# Altium schematic sheet BUZT13-01CN-E-201-20140930.SchDoc
size B; SheetNumber: 0; SheetTotal: 0
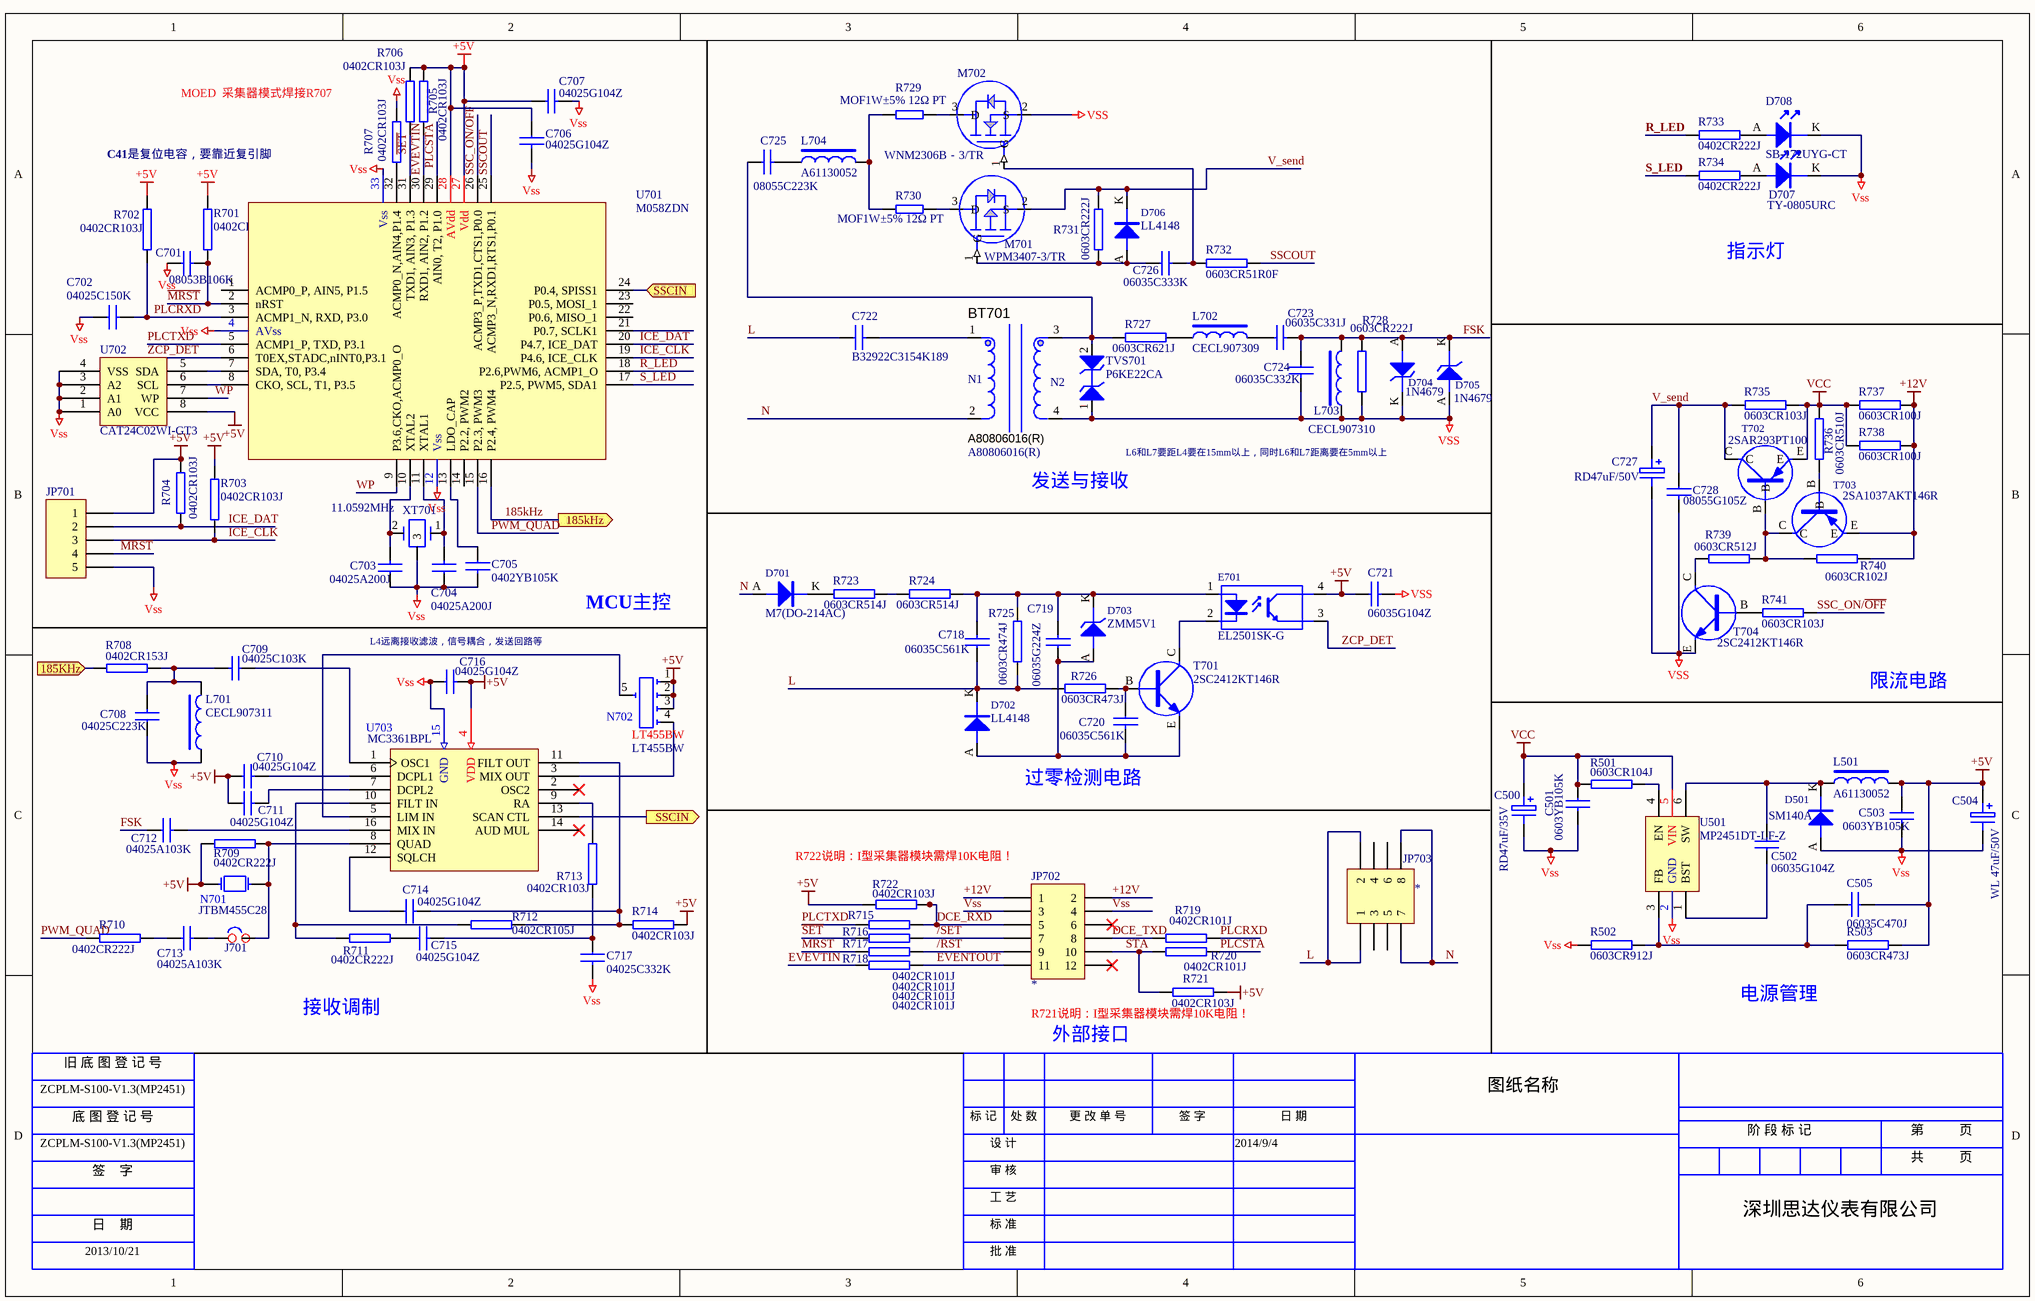
[diagram p0: BUZT13-01CN-E-201-20140930.SchDoc]

## Parts
BT701  A80806016(R)  [OHXQ_1]
C500  RD47uF/35V  [CAP_ELE_5.0_2.0]
C501  0603YB105K  [CAP_SMD_0603]
C502  06035G104Z  [CAP_SMD_0603]
C503  0603YB105K  [CAP_SMD_0603]
C504  WL 47uF/50V  [CAP_ELE_6.3_2.5]
C505  06035C470J  [CAP_SMD_0603]
C701  08053B106K  [CAP_SMD_0805]
C702  04025C150K  [CAP_SMD_0402]
C703  04025A200J  [CAP_SMD_0402]
C704  04025A200J  [CAP_SMD_0402]
C705  0402YB105K  [CAP_SMD_0402]
C706  04025G104Z  [CAP_SMD_0402]
C707  04025G104Z  [CAP_SMD_0402]
C708  04025C223K  [CAP_SMD_0402]
C709  04025C103K  [CAP_SMD_0402]
C710  04025G104Z  [CAP_SMD_0402]
C711  04025G104Z  [CAP_SMD_0402]
C712  04025A103K  [CAP_SMD_0402]
C713  04025A103K  [CAP_SMD_0402]
C714  04025G104Z  [CAP_SMD_0402]
C715  04025G104Z  [CAP_SMD_0402]
C716  04025G104Z  [CAP_SMD_0402]
C717  04025C332K  [CAP_SMD_0402]
C718  06035C561K  [CAP_SMD_0603]
C719  06035G224Z  [CAP_SMD_0603]
C720  06035C561K  [CAP_SMD_0603]
C721  06035G104Z  [CAP_SMD_0603]
C722  B32922C3154K189  [CAP_PFC_15_18_8.5]
C723  06035C331J  [CAP_SMD_0603]
C724  06035C332K  [CAP_SMD_0603]
C725  08055C223K  [CAP_SMD_0805]
C726  06035C333K  [CAP_SMD_0603]
C727  RD47uF/50V  [CAP_ELE_6.3_2.5]
C728  08055G105Z  [CAP_SMD_0805]
D501  SM140A  [DO-214AC]
D701  M7(DO-214AC)  [DO-214AC]
D702  LL4148  [LL-34]
D703  ZMM5V1  [LL-34]
D704  1N4679  [DIODE-I]
D705  1N4679  [DIODE-I]
D706  LL4148  [LL-34]
D707  TY-0805URC  [LED_0805]
D708  SB-172UYG-CT  [LED_0805]
E701  EL2501SK-G  [OPT_SOP]
J701  CA_PAD  [CA_PAD]  (value not drawn)
JP701  (no value)  [CON_S_5]
JP702  *  [CON_D_12]
JP703  *  [CON_D_8]
L501  A61130052  [IND_PLU_2_5]
L701  CECL907311  [L4.0-4.5]
L702  CECL907309  [L4.0-4.5]
L703  CECL907310  [L4.0-4.5]
L704  A61130052  [IND_PLU_2_5]
M701  WPM3407-3/TR  [SOT-23-3]
M702  WNM2306B－3/TR  [SOT-23-3]
N701  JTBM455C28  [JTBM455C28]
N702  LT455BW  [LT4551]
R501  0603CR104J  [RES_SMD_0603]
R502  0603CR912J  [RES_SMD_0603]
R503  0603CR473J  [RES_SMD_0603]
R701  0402CR103J  [RES_SMD_0402]
R702  0402CR103J  [RES_SMD_0402]
R703  0402CR103J  [RES_SMD_0402]
R704  0402CR103J  [RES_SMD_0402]
R705  0402CR103J  [RES_SMD_0402]
R706  0402CR103J  [RES_SMD_0402]
R707  0402CR103J  [RES_SMD_0402]
R708  0402CR153J  [RES_SMD_0402]
R709  0402CR222J  [RES_SMD_0402]
R710  0402CR222J  [RES_SMD_0402]
R711  0402CR222J  [RES_SMD_0402]
R712  0402CR105J  [RES_SMD_0402]
R713  0402CR103J  [RES_SMD_0402]
R714  0402CR103J  [RES_SMD_0402]
R715  0402CR101J  [RES_SMD_0402]
R716  0402CR101J  [RES_SMD_0402]
R717  0402CR101J  [RES_SMD_0402]
R718  0402CR101J  [RES_SMD_0402]
R719  0402CR101J  [RES_SMD_0402]
R720  0402CR101J  [RES_SMD_0402]
R721  0402CR103J  [RES_SMD_0402]
R722  0402CR103J  [RES_SMD_0402]
R723  0603CR514J  [RES_SMD_0603]
R724  0603CR514J  [RES_SMD_0603]
R725  0603CR474J  [RES_SMD_0603]
R726  0603CR473J  [RES_SMD_0603]
R727  0603CR621J  [RES_SMD_0603]
R728  0603CR222J  [RES_SMD_0603]
R729  MOF1W±5% 12Ω PT  [LCEC-101L]
R730  MOF1W±5% 12Ω PT  [LCEC-101L]
R731  0603CR222J  [RES_SMD_0603]
R732  0603CR51R0F  [RES_SMD_0603]
R733  0402CR222J  [RES_SMD_0402]
R734  0402CR222J  [RES_SMD_0402]
R735  0603CR103J  [RES_SMD_0603]
R736  0603CR510J  [RES_SMD_0603]
R737  0603CR100J  [RES_SMD_0603]
R738  0603CR100J  [RES_SMD_0603]
R739  0603CR512J  [RES_SMD_0603]
R740  0603CR102J  [RES_SMD_0603]
R741  0603CR103J  [RES_SMD_0603]
T701  2SC2412KT146R  [SOT-23_BCE]
T702  2SAR293PT100  [SOT-428]
T703  2SA1037AKT146R  [SOT-23_BCE]
T704  2SC2412KT146R  [SOT-23_BCE]
TVS701  P6KE22CA  [TVS0.14L]
U501  MP2451DT-LF-Z  [SOT-23 - 6L]
U701  M058ZDN  [QFN-33]
U702  CAT24C02WI-GT3  [SO-8]
U703  MC3361BPL  [SOP-16]
XT701  11.0592MHz  [XTAL_PLU_HC-49US]

## Ports
185KHz (in), 185kHz (out), SSCIN (in), SSCIN (out)

## Nets
+5V: C503.1 C504.1 C505.1 C706.1 C707.1 C710.1 C711.1 C716.2 C721.1 E701.4(C) JP701.1 L501.2 N701.1 N702.1 N702.2 N702.3 R503.2 R701.1 R702.1 R703.2 R704.2 R705.1 R706.1 R709.1 R714.2 R721.2 R722.1 U701.27(Vdd) U701.28(AVdd) U702.8(VCC) U703.4(VDD)
+12V: JP702.1 JP702.2 R737.2 R738.2 R740.2 T703.E
VCC: C500.1 C501.1 R501.1 R735.2 R736.2 R737.1 R738.1 T702.E U501.5(VIN)
Vss: BT701.4(B2) C500.2 C501.2 C503.2 C504.2 C701.1 C702.1 C703.1 C704.1 C705.2 C706.2 C707.2 C708.1 C716.1 C717.2 C721.2 C724.2 C727.2 C728.2 D501.A D704.K D705.A D707.K D708.K JP701.5 JP702.3 JP702.4 L701.1 L703.1 M702.2(S) R502.1 R707.1 R728.1 T704.E TVS701.1 U501.2(GND) U701.4(AVss) U701.12(Vss) U701.33(Vss) U702.1(A0) U702.2(A1) U702.3(A2) U702.4(VSS) U703.15(GND) XT701.3
185kHz: R708.1 U701.16(P2.4,_PWM4) ; port 185KHz, port 185kHz
/RST: JP702.9 R717.2
/SET: JP702.7 R716.2
DCE_RXD: JP702.5 R715.2 R722.2
DCE_TXD: JP702.8 R719.1
EVENTOUT: JP702.11 R718.2
EVEVTIN: R705.2 R718.1 U701.30(RXD1,_AIN2,_P1.2)
FSK: C712.1 C723.2 C724.1 D704.A D705.K L703.2 R728.2
ICE_CLK: JP701.3 R703.1 U701.19(P4.6,_ICE_CLK)
ICE_DAT: JP701.2 R704.1 U701.20(P4.7,_ICE_DAT)
L: C718.1 C722.1 D702.K JP703.1 JP703.2 R725.1 R726.1
~{MRST}: C701.2 JP701.4 R701.2 R717.1 U701.2(nRST)
N: BT701.2(A2) D701.A JP703.7 JP703.8
PLCRXD: C702.2 R702.2 R719.2 U701.3(ACMP1_N,_RXD,_P3.0)
PLCSTA: R720.2 U701.29(AIN0,_T2,_P1.0)
PLCTXD: R715.1 U701.5(ACMP1_P,_TXD,_P3.1)
PWM_QUAD: R710.1 U701.15(P2.3,_PWM3)
R_LED: R733.1 U701.18(P2.6,PWM6,_ACMP1_O)
~{SET}: R706.2 R716.1 U701.31(TXD1,_AIN3,_P1.3)
S_LED: R734.1 U701.17(P2.5,_PWM5,_SDA1)
SSC_ON/~{OFF}: R741.2 U701.26(ACMP3_P,TXD1,CTS1,P0.0)
SSCIN: U701.24(P0.4,_SPISS1) U703.13(SCAN_CTL) ; port SSCIN
SSCOUT: R732.2 U701.25(ACMP3_N,RXD1,RTS1,P0.1)
STA: JP702.10 R720.1 R721.1
V_send: C727.1 C728.1 D706.K M701.2(S) R731.2 R735.1 T702.C
WP: U701.9(P3.6,CKO,ACMP0_O) U702.7(WP)
ZCP_DET: E701.3(E) U701.6(T0EX,STADC,nINT0,P3.1)
NetBT701_1: BT701.1(A1) C722.2
NetBT701_3: BT701.3(B1) C725.1 R727.1 TVS701.2(K)
NetC502_1: C502.1 U501.1(BST)
NetC502_2: C502.2 D501.K L501.1 U501.6(SW)
NetC505_2: C505.2 R502.2 R503.1 U501.3(FB)
NetC703_2: C703.2 U701.10(XTAL2) XT701.2(S4)
NetC704_2: C704.2 U701.11(XTAL1) XT701.1(S1)
NetC705_1: C705.1 U701.13(LDO_CAP)
NetC708_2: C708.2 C709.2 L701.2 R708.2
NetC709_1: C709.1 U703.1(OSC1)
NetC710_2: C710.2 U703.6(DCPL1)
NetC711_2: C711.2 U703.7(DCPL2)
NetC712_2: C712.2 U703.16(MIX_IN)
NetC713_1: C713.1 R710.2
NetC713_2: C713.2 J701.1
NetC714_1: C714.1 U703.12(SQLCH)
NetC714_2: C714.2 R712.2 R714.1 U703.11(FILT_OUT)
NetC715_1: C715.1 R711.2
NetC715_2: C715.2 C717.1 R713.1
NetC718_2: C718.2 C719.2 D703.K E701.1(A) R724.2 R725.2
NetC719_1: C719.1 C720.2 D702.A D703.A T701.E
NetC720_1: C720.1 R726.2 T701.B
NetC723_1: C723.1 L702.2
NetC725_2: C725.2 L704.1
NetC726_1: C726.1 D706.A M701.1(G) R731.1
NetC726_2: C726.2 M702.1(G) R732.1
NetD701_K: D701.K R723.1
NetD707_A: D707.A R734.2
NetD708_A: D708.A R733.2
NetE701_2: E701.2(K) T701.C
NetJ701_2: J701.2 N701.2 R709.2 U703.8(QUAD)
NetL702_1: L702.1 R727.2
NetL704_2: L704.2 R729.1 R730.1
NetM701_3: M701.3(D) R730.2
NetM702_3: M702.3(D) R729.2
NetN702_4: N702.4 U703.3(MIX_OUT)
NetN702_5: N702.5 U703.5(LIM_IN)
NetR501_2: R501.2 U501.4(EN)
NetR707_2: R707.2 U701.32(ACMP0_N,AIN4,P1.4)
NetR711_1: R711.1 R712.1 U703.10(FILT_IN)
NetR713_2: R713.2 U703.9(RA)
NetR723_2: R723.2 R724.1
NetR736_1: R736.1 T703.B
NetR739_1: R739.1 T704.C
NetR739_2: R739.2 R740.1 T702.B T703.C
NetR741_1: R741.1 T704.B
NetU701_7: U701.7(SDA,_T0,_P3.4) U702.5(SDA)
NetU701_8: U701.8(CKO,_SCL,_T1,_P3.5) U702.6(SCL)

Not connected (* = marked no-connect by the designer): JP702 6* 12*; JP703 3 4 5 6; U701 1(ACMP0_P,_AIN5,_P1.5) 14(P2.2,_PWM2) 21(P0.7,_SCLK1) 22(P0.6,_MISO_1) 23(P0.5,_MOSI_1); U703 2(OSC2)* 14(AUD_MUL)*

## Notes on the sheet
- MOED  采集器模式焊接R707
- C41是复位电容，要靠近复引脚
- 指示灯
- 发送与接收
- L6和L7要距L4要在15mm以上，同时L6和L7距离要在5mm以上
- (near C716) L4远离接收滤波，信号耦合，发送回路等
- MCU主控
- 限流电路
- 过零检测电路
- R722说明：I型采集器模块需焊10K电阻！
- 接收调制
- (near R721) R721说明：I型采集器模块需焊10K电阻！
- 外部接口
- 电源管理
- 旧 底 图 登 记 号
- ZCPLM-S100-V1.3(MP2451)
- 底 图 登 记 号
- 签    字
- 标 记
- 设 计
- 审 核
- 处 数
- 更 改 单 号
- 签 字
- 日 期
- 2014/9/4
- 图纸名称
- 阶 段 标 记
- 第          页
- 共          页
- 日    期
- 工 艺
- 标 准
- DDSI780单相电子式
- V5.0
- 1
- 2013/10/21
- 批 准
- 深圳思达仪表有限公司
- (in symbol 2115BU01CN01) N1; N2

## Library data of the parts
BT701 = 2115BU01CN01: Name: 耦合线圈（预研项目物料）; Spec: 插件,原边1000uH,副边1000uH; Value: A80806016(R); Part Number: 2115BU01CN01; Part Type: 2115-耦合线圈
C500 = 203204705102: Name: 电解电容; Spec: 47uF,插件,Ф5×11,脚距:2.0mm,±20%,35V,2000h,-55～＋105℃,三和; Value: RD47uF/35V; Part Number: 203204705102; Part Type: 电解电容脚距2.0
C501 C503 C705 = 203031052501: Name: 贴片电容; Spec: 1μF,0603,±10%,X5R,16V; Part Number: 203031052501; Part Type: 贴片电容封装0603
  C501 C503: Value: 0603YB105K
  C705: Value: 0402YB105K
C502 C706 C707 C710 C711 C714-C716 C721 = 203031044302: Name: 贴片电容; Spec: 100nF,0603,Z=+80 -20%,Y5V,50V; Part Number: 203031044302; Part Type: 贴片电容封装0603
  C502 C721: Value: 06035G104Z
  C706 C707 C710 C711 C714-C716: Value: 04025G104Z
C504 = YZ0100000213: Name: 电解电容; Spec: 47uF,插件,Ф6.3×11, 50V,5000h,脚距:2.5mm, -55～＋105℃; Value: WL 47uF/50V; Part Number: YZ0100000213; Part Type: YZ01-郑州产品电子物料
C505 = 203034704201: Name: 贴片电容; Spec: 47pF,0603,±5%,X7R,50V; Value: 06035C470J; Part Number: 203034704201; Part Type: 贴片电容封装0603
C701 = 203021063501: Name: 贴片电容; Spec: 10uF,0805,±10%,X5R,25V; Value: 08053B106K; Part Number: 203021063501; Part Type: 贴片电容封装0805
C702 = 203031504201: Name: 贴片电容; Spec: 15pF,0603,±10%,X7R,50V; Value: 04025C150K; Part Number: 203031504201; Part Type: 贴片电容封装0603
C703 C704 = 203032004101: Name: 贴片电容; Spec: 20pF,0603,±5%,NPO,50V; Value: 04025A200J; Part Number: 203032004101; Part Type: 贴片电容封装0603
C708 = 203032234201: Name: 贴片电容; Spec: 22nF,0603,±10%,X7R,50V; Value: 04025C223K; Part Number: 203032234201; Part Type: 贴片电容封装0603
C709 = 203031034201: Name: 贴片电容; Spec: 10nF,0603,±10%,X7R,50V; Value: 04025C103K; Part Number: 203031034201; Part Type: 贴片电容封装0603
C712 C713 = 203031034101: Name: 贴片电容; Spec: 10nF,0603,±10%,NPO,50V; Value: 04025A103K; Part Number: 203031034101; Part Type: 贴片电容封装0603
C717 C724 = 203033324201: Name: 贴片电容; Spec: 3.3nF,0603,±10%,X7R,50V; Part Number: 203033324201; Part Type: 贴片电容封装0603
  C717: Value: 04025C332K
  C724: Value: 06035C332K
C718 C720 = 203035614201: Name: 贴片电容; Spec: 560pF,0603,±10%,X7R,50V; Value: 06035C561K; Part Number: 203035614201; Part Type: 贴片电容封装0603
C719 = 203032244302: Name: 贴片电容; Spec: 220nF,0603,Z=+80 -20%,Y5V,50V; Value: 06035G224Z; Part Number: 203032244302; Part Type: 贴片电容封装0603
C722 = 203315430401: Name: 薄膜电容; Spec: 0.15uF,插件,脚距:15mm,±10%,额定电压：305VAC,耐压：2121V，2S ,小于110℃,EPCOS; Value: B32922C3154K189; Part Number: 203315430401; Part Type: 聚脂电容脚距15
C723 = YZ0100000211: Name: 0603贴片电容; Spec: NPO,50V,±5%; Value: 06035C331J; Part Number: YZ0100000211; Part Type: YZ01-郑州产品电子物料
C725 = 203022234202: Name: 贴片电容; Spec: 22nF,0805,±10%,X7R,50V; Value: 08055C223K; Part Number: 203022234202; Part Type: 贴片电容封装0805
C726 = 203033334201: Name: 贴片电容; Spec: 33nF,0603,±10%,X7R,50V; Value: 06035C333K; Part Number: 203033334201; Part Type: 贴片电容封装0603
C727 = 203204706201: Name: 电解电容; Spec: 47uF,插件,Ф6×12,脚距:2.5mm,±20%,50V,1000h,-55～＋105℃,三和; Value: RD47uF/50V; Part Number: 203204706201; Part Type: 电解电容脚距2.5
C728 = 203021054302: Name: 贴片电容; Spec: 1uF,0805,Z=+80 -20%,Y5V,50V; Value: 08055G105Z; Part Number: 203021054302; Part Type: 贴片电容封装0805
D501 = 205105012002: Name: 肖特基二极管（预研项目物料）; Spec: 贴片DO-214AC,肖特基,1.0A,反向耐压：40V,正向压降：0.50V,–40 to +125℃,-; Value: SM140A; Part Number: 205105012002; Part Type: 贴片肖特基二极管
D701 = 205101012001: Name: 整流二极管; Spec: 贴片DO-214AC,硅管,1.0A,反向耐压：1000V,正向压降：1.1V,-55~150℃,标识：M7; Value: M7(DO-214AC); Part Number: 205101012001; Part Type: 贴片硅管
D702 D706 = 205205012002: Name: 开关二极管; Spec: 贴片LL-34,300mA,正向压降：0.8V,反向耐压：75V,开关时间：4ns,150oC,标识：LL4148; Value: LL4148; Part Number: 205205012002; Part Type: 贴片开关二极管
D703 = 205000003201: Name: 稳压二极管; Spec: 贴片LL-34,5.1V,0.5W,±5％,标识：ZMM5V1,ST先科; Value: ZMM5V1; Part Number: 205000003201; Part Type: 贴片稳压二极管
D704 D705 = 205046793101: Name: 稳压二极管（预研项目物料）; Spec: 插件DO-35,2V,0.5W,±5％,-,ST; Value: 1N4679; Part Number: 205046793101; Part Type: 插件稳压二极管
D707 = 210017100203: Name: 发光二极管; Spec: 0805,无色透明,红色,高亮,2.5 V,20 mA,5 V,-40~85℃,130mCD; Value: TY-0805URC; Part Number: 210017100203; Part Type: 贴片发光二极管0805
D708 = 210017G00301: Name: 发光二极管; Spec: 0805,无色透明,发绿色,超高亮,2.1V,30mA,5V,-30~80℃,45mcd; Value: SB-172UYG-CT; Part Number: 210017G00301; Part Type: 贴片发光二极管0805
E701 = 210402012002: Name: 贴片光耦; Spec: 贴片,5.0kV,CTR：300~600%,-55~+110℃,5V,Vceo:80V,Everlight (亿光); Value: EL2501SK-G; Part Number: 210402012002; Part Type: 贴片光耦
J701 = 291000000001: WithOutBom; Name: 虚拟修调焊盘; Part Number: 291000000001; Part Type: 虚拟元器件
JP701 = 230105140001: Name: 插座; Spec: 五芯,单排,脚距:2.54mm,普通; Part Number: 230105140001; Part Type: 2301-插座
JP702 = 230212104005: Name: 排针; Spec: 十二芯,双排,直脚,脚距:2.54mm,-40℃~105℃; Value: *; Part Number: 230212104005; Part Type: 2302-排针
JP703 = 230308104002: Name: 排针插座; Spec: 10.56*5.0*7.1mm,8芯(4*2), 中间四芯为空,双排,直脚,脚距:2.54mm,图号：DDZY23C-Z-01CN-JQ28-03-C  A0; Value: *; Part Number: 230308104002; Part Type: 2303-排针插座
L501 L704 = 211110012002: Name: 插件电感（预研项目物料）; Spec: 插件,10uH,±10%,1.2A,-,-,0.12Ω,-,中山市高雅; Value: A61130052; Part Number: 211110012002; Part Type: 2111-插件电感
L701 = 211133003201: Name: 插件电感（预研项目物料）; Spec: 插件0410,33uH,±5%,320mA,Q值:30(Min),6.0MHz,1.1Ω,-,中山市高雅; Value: CECL907311; Part Number: 211133003201; Part Type: 2111-插件电感
L702 = 211110200601: Name: 插件电感（预研项目物料）; Spec: 插件0410,1.0mH,±5%,60mA,Q值:45(Min),1.0MHz,20Ω,-,中山市高雅; Value: CECL907309; Part Number: 211110200601; Part Type: 2111-插件电感
L703 = 211110101604: Name: 插件电感（预研项目物料）; Spec: 插件0410,100uH,±5%,160mA,Q值:30(Min),3.5MHz,3.5Ω,-,中山市高雅; Value: CECL907310; Part Number: 211110101604; Part Type: 2111-插件电感
M701 = 208105022001: Name: 场效应管; Spec: SOT-23-3,P沟道增强型FET,WP7Z,willsemi; Value: WPM3407-3/TR; Part Number: 208105022001; Part Type: 场效应管(MOS管)P沟道
M702 = 208105012001: Name: 场效应管; Spec: SOT-23-3,N沟道增强型FET,-,willsemi; Value: WNM2306B－3/TR; Part Number: 208105012001; Part Type: 场效应管(MOS管)N沟道
N701 = 207202011001: Name: 陶瓷鉴频器（预研项目物料）; Spec: 插件,-20~+80℃,江佳; Value: JTBM455C28; Part Number: 207202011001; Part Type: 2072-滤波器
N702 = 207202011002: Name: 陶瓷滤波器（预研项目物料）; Spec: 插件,-20~+80℃,江佳; Value: LT455BW; Part Number: 207202011002; Part Type: 2072-滤波器
R501 = 201031003301: Name: 贴片电阻; Spec: 100KΩ,0603,±5%,耐压:>100V,1/10W,±100ppm/℃; Value: 0603CR104J; Part Number: 201031003301; Part Type: 贴片电阻封装0603精度J
R502 = 201039101001: Name: 贴片电阻; Spec: 9.1KΩ,0603,±5%,耐压:>100V,1/10W,±100ppm/℃; Value: 0603CR912J; Part Number: 201039101001; Part Type: 贴片电阻封装0603精度J
R503 R726 = 201034702301: Name: 贴片电阻; Spec: 47KΩ,0603,±5%,耐压:>100V,1/10W,±100ppm/℃; Value: 0603CR473J; Part Number: 201034702301; Part Type: 贴片电阻封装0603精度J
R701-R707 R713 R714 R721 R722 R735 R741 = 201031002301: Name: 贴片电阻; Spec: 10KΩ,0603,±5%,耐压:>100V,1/10W,±100ppm/℃; Part Number: 201031002301; Package Type: 贴片; Part Type: 贴片电阻封装0603精度J
  R701-R707 R713 R714 R721 R722: Value: 0402CR103J
  R735 R741: Value: 0603CR103J
R708 = 201031502301: Name: 贴片电阻; Spec: 15KΩ,0603,±5%,耐压:>100V,1/10W,±100ppm/℃; Value: 0402CR153J; Part Number: 201031502301; Part Type: 贴片电阻封装0603精度J
R709-R711 R728 R731 R733 R734 = 201032201301: Name: 贴片电阻; Spec: 2.2KΩ,0603,±5%,耐压:>100V,1/10W,±100ppm/℃; Part Number: 201032201301; Part Type: 贴片电阻封装0603精度J
  R709-R711 R733 R734: Value: 0402CR222J
  R728 R731: Value: 0603CR222J
R712 = 201031004301: Name: 贴片电阻; Spec: 1MΩ,0603,±5%,耐压:>100V,1/10W,±100ppm/℃; Value: 0402CR105J; Part Number: 201031004301; Part Type: 贴片电阻封装0603精度J
R715-R720 = 201031000301: Name: 贴片电阻; Spec: 100Ω,0603,±5%,耐压:>100V,1/10W,±100ppm/℃; Value: 0402CR101J; Part Number: 201031000301; Part Type: 贴片电阻封装0603精度J
R723 R724 = 201035103301: Name: 贴片电阻; Spec: 510KΩ,0603,±5%,耐压:>100V,1/10W,±100ppm/℃; Value: 0603CR514J; Part Number: 201035103301; Part Type: 贴片电阻封装0603精度J
R725 = 201034703301: Name: 贴片电阻; Spec: 470KΩ,0603,±5%,耐压:>100V,1/10W,±100ppm/℃; Value: 0603CR474J; Part Number: 201034703301; Part Type: 贴片电阻封装0603精度J
R727 = 201036200301: Name: 贴片电阻; Spec: 620Ω,0603,±5%,耐压:>100V,1/10W,±100ppm/℃; Value: 0603CR621J; Part Number: 201036200301; Part Type: 贴片电阻封装0603精度J
R729 R730 = 201101201401: Name: 精密金属膜电阻（预研项目物料）; Spec: 12Ω,插件,±5%,耐压:350V,1W,+350~-500PPM/℃,-55℃-155℃; Value: MOF1W±5% 12Ω PT; Part Number: 201101201401; Part Type: 2011-金属膜电阻
R732 = 201030510101: Name: 贴片电阻; Spec: 51Ω,0603,±1%,耐压:>100V,1/10W,±100ppm/℃; Value: 0603CR51R0F; Part Number: 201030510101; Part Type: 贴片电阻封装0603精度F
R736 = 201030510301: Name: 贴片电阻; Spec: 51Ω,0603,±5%,耐压:>100V,1/10W,±100ppm/℃; Value: 0603CR510J; Part Number: 201030510301; Part Type: 贴片电阻封装0603精度J
R737 R738 = 201030100301: Name: 贴片电阻; Spec: 10Ω,0603,±5%,耐压:>100V,1/10W,±200ppm/℃; Value: 0603CR100J; Part Number: 201030100301; Part Type: 贴片电阻封装0603精度J
R739 = 201035101301: Name: 贴片电阻; Spec: 5.1KΩ,0603,±5%,耐压:>100V,1/10W,±100ppm/℃; Value: 0603CR512J; Part Number: 201035101301; Part Type: 贴片电阻封装0603精度J
R740 = 201031001301: Name: 贴片电阻; Spec: 1000Ω,0603,±5%,耐压:>100V,1/10W,±100ppm/℃; Value: 0603CR102J; Part Number: 201031001301; Part Type: 贴片电阻封装0603精度J
T701 T704 = 208011012003: Name: 三极管（预研项目物料）; Spec: 贴片SOT-23,NPN,50V,0.15A,–55~+150℃,-; Value: 2SC2412KT146R; Part Number: 208011012003; Part Type: 贴片三极管NPN
T702 = 208010012003: Name: 三极管（预研项目物料）; Spec: 贴片MPT3,PNP,30V,1A,-55~+150℃,-; Value: 2SAR293PT100; Part Number: 208010012003; Part Type: 贴片三极管PNP
T703 = 208010012004: Name: 三极管（预研项目物料）; Spec: 贴片SOT-23,PNP,50V,0.15A,-55~+150℃,-; Value: 2SA1037AKT146R; Part Number: 208010012004; Part Type: 贴片三极管PNP
TVS701 = 205401521004: Name: 瞬变抑制二极管/TVS（预研项目物料）; Spec: 插件DO-15,600W,15V,双向,-55~175℃,±5%,标识：P6KE22CA; Value: P6KE22CA; Part Number: 205401521004; Part Type: 插件TVS管-双向
U501 = 215413011001: Name: DC-DC芯片; Spec: 输出电压：36V,SOT23-6L,-40-+125℃,MPS,-,0.6A,-,标示:V7; Value: MP2451DT-LF-Z; Part Number: 215413011001; Part Type: 2154-电源转换器
U701 = 217820013101: Name: MCU（预研项目物料）; Spec: FLASH,封装片,-40~+85℃,2.5～5.5V,QFN-33,Nuvoton（新唐科技）; Value: M058ZDN; Part Number: 217820013101; Part Type: 2178-MCU
U702 = 217020002201: Name: 存储器; Spec: 1.8～5.5V,-40～+85℃,2Kbit,贴片SO-8,标识:24C02H,ON Semi; Value: CAT24C02WI-GT3; Part Number: 217020002201; Part Type: 2170-存储器
U703 = 217405012001: Name: 解调芯片（预研项目物料）; Spec: -20 ~ +70℃,2.5~7.0V,贴片SOP-16,UNISONIC（友顺科技）; Value: MC3361BPL; Part Number: 217405012001; Part Type: 2174-载波芯片
XT701 = 207011M03402: Name: 晶体谐振器(晶振); Spec: HC-49US,11.0592MHz,±10ppm,15pF,-40～+85℃; Value: 11.0592MHz; Part Number: 207011M03402; Part Type: 高频晶振1MHz(含)以上